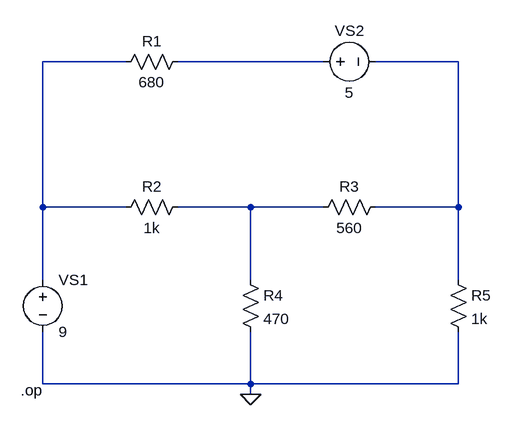
[diagram p0: schematic sim1.asc]
sim1.asc, the LTspice schematic file:
Version 4
SHEET 1 880 680
WIRE -64 -32 -192 -32
WIRE 128 -32 16 -32
WIRE 240 -32 128 -32
WIRE 448 -32 320 -32
WIRE -192 192 -192 -32
WIRE -64 192 -192 192
WIRE 128 192 16 192
WIRE 240 192 128 192
WIRE 448 192 448 -32
WIRE 448 192 320 192
WIRE 448 304 448 192
WIRE -192 304 -192 192
WIRE 128 304 128 192
WIRE -192 464 -192 384
WIRE -48 464 -192 464
WIRE 128 464 128 384
WIRE 128 464 -48 464
WIRE 304 464 128 464
WIRE 448 464 448 384
WIRE 448 464 304 464
WIRE 128 480 128 464
FLAG 128 480 0
DATAFLAG 128 -32 "round(1meg*I(Vs2))/1meg"
DATAFLAG -32 32 "round(1k*(V(n001)-V(n001)+680*I(R1)))/1k"
DATAFLAG -32 256 "round(1k*(V(n001)-V(n001)+1k*I(R2)))/1k"
DATAFLAG -48 464 "round(-1meg*I(Vs1))/1meg"
DATAFLAG 288 256 "round(1k*(V(n001)-V(n001)+560*I(R3)))/1k"
DATAFLAG 176 400 "round(1k*(V(n001)-V(n001)+470*I(R4)))/1k"
DATAFLAG 496 400 "round(1k*(V(n001)-V(n001)+1k*I(R5)))/1k"
DATAFLAG 304 464 "round(1meg*I(R5))/1meg"
SYMBOL voltage -192 288 R0
WINDOW 123 0 0 Left 2
WINDOW 39 0 0 Left 2
SYMATTR InstName VS1
SYMATTR Value 9
SYMBOL res -80 208 R270
WINDOW 0 32 56 VTop 2
WINDOW 3 0 56 VBottom 2
SYMATTR InstName R2
SYMATTR Value 1k
SYMBOL res 224 208 R270
WINDOW 0 32 56 VTop 2
WINDOW 3 0 56 VBottom 2
SYMATTR InstName R3
SYMATTR Value 560
SYMBOL res 112 288 R0
SYMATTR InstName R4
SYMATTR Value 470
SYMBOL res -80 -16 R270
WINDOW 0 32 56 VTop 2
WINDOW 3 0 56 VBottom 2
SYMATTR InstName R1
SYMATTR Value 680
SYMBOL res 432 288 R0
SYMATTR InstName R5
SYMATTR Value 1k
SYMBOL voltage 224 -32 R270
WINDOW 0 32 56 VTop 2
WINDOW 3 -32 56 VBottom 2
WINDOW 123 0 0 Left 2
WINDOW 39 0 0 Left 2
SYMATTR InstName VS2
SYMATTR Value 5
TEXT -226 474 Left 2 !.op

The netlist it stands for:
* sim1.asc
VS1 N001 0 9
R2 N001 N004 1k
R3 N004 N003 560
R4 N004 0 470
R1 N001 N002 680
R5 N003 0 1k
VS2 N002 N003 5
.op
.backanno
.end